# EAGLE design printer_v1 (EAGLE 9.6.2)
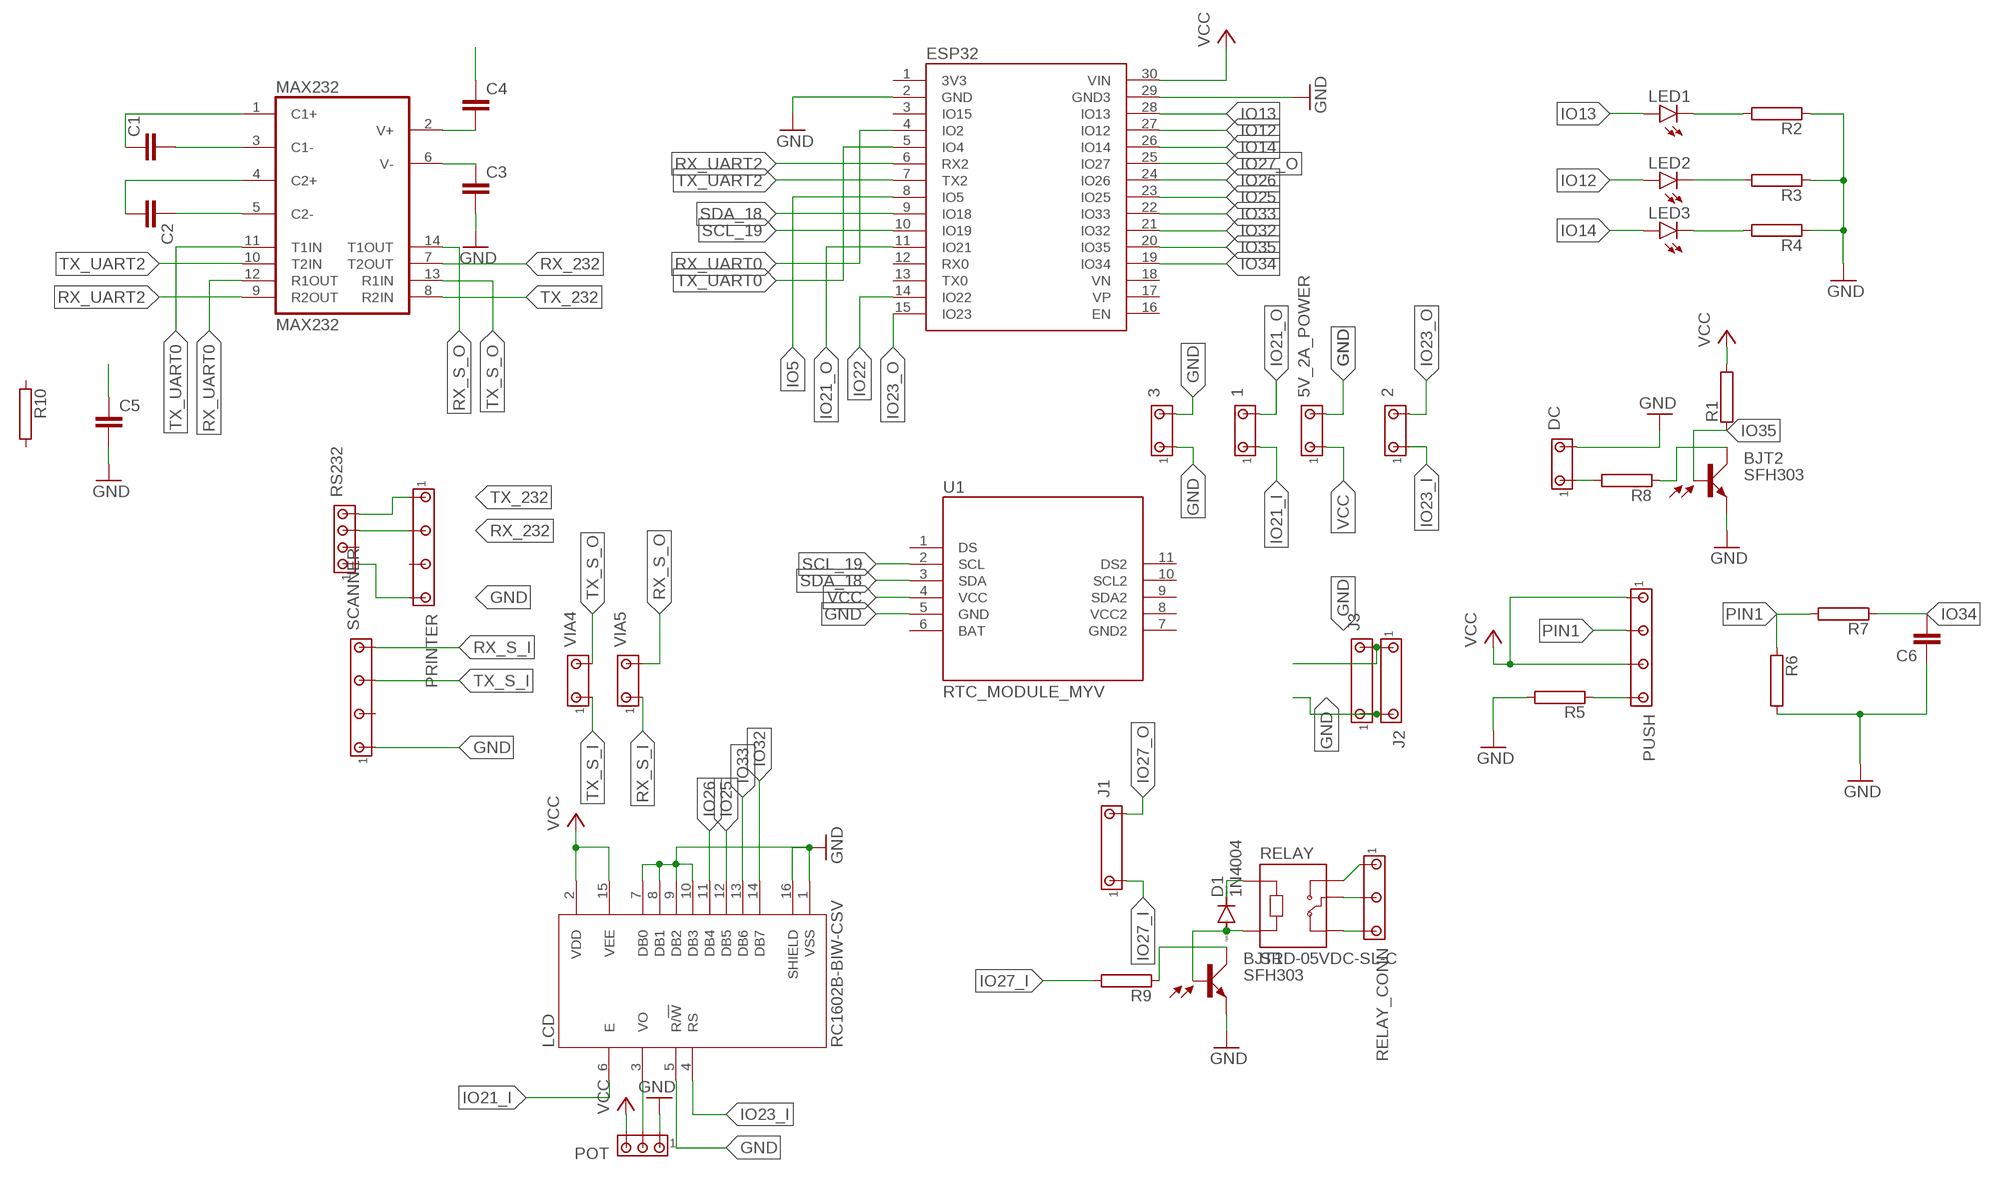
[diagram p0: schematic, sheet 1]

## Parts
1  MTA03-100_MYV  [10X03MTA_MYV]
2  MTA03-100_MYV  [10X03MTA_MYV]
3  MTA03-100_MYV  [10X03MTA_MYV]
5V_2A_POWER  MTA03-100_MYV  [10X03MTA_MYV]
BJT1  SFH303  [SFH303]
BJT2  SFH303  [SFH303]
C1  C-EU025-024X044  [C025-024X044]
C2  C-EU025-024X044  [C025-024X044]
C3  C-EU025-024X044  [C025-024X044]
C4  C-EU025-024X044  [C025-024X044]
C5  C-EU025-024X044  [C025-024X044]
C6  C-EU025-024X044  [C025-024X044]
D1  1N4004  [DO41-10]
DC  MTA03-100_MYV  [10X03MTA_MYV]
ESP32  MODULE_ESP32_MYV  [MODULE_ESP32-DEVKITC-MYV]
J1  MTA02-LARGE_MYVSPACE1  [10X02MTA_LARGE_MYV]
J2  MTA02-LARGE_MYVSPACE1  [10X02MTA_LARGE_MYV]
J3  MTA02-LARGE_MYVSPACE1  [10X02MTA_LARGE_MYV]
LCD  RC1602B-BIW-CSV  [LCD_RC1602B-BIW-CSV]
LED1  LED3MM  [LED3MM]
LED2  LED3MM  [LED3MM]
LED3  LED3MM  [LED3MM]
MAX232  MAX232  [DIL16]
POT  MTA03-100  [10X03MTA]
PRINTER  MTA07-100_MYV  [10X07MTA_MYV]
PUSH  MTA07-100_MYV  [10X07MTA_MYV]
R1  RHPS58  [HPS58]
R2  RHPS58  [HPS58]
R3  RHPS58  [HPS58]
R4  RHPS58  [HPS58]
R5  RHPS58  [HPS58]
R6  RHPS58  [HPS58]
R7  RHPS58  [HPS58]
R8  RHPS58  [HPS58]
R9  RHPS58  [HPS58]
R10  RHPS58  [HPS58]
RELAY  SRD-05VDC-SL-C  [RELAY_SRD-05VDC-SL-C]
RELAY_CONN  MTA05-156_MYVSPACE1  [10X05MTA_MYV]
RS232  MTA04-100  [10X04MTA]
SCANNER  MTA07-100_MYV  [10X07MTA_MYV]
U1  RTC_MODULE_MYV  [RTC_MYV]
VIA4  MTA03-100_MYV  [10X03MTA_MYV]
VIA5  MTA03-100_MYV  [10X03MTA_MYV]

## Nets
GND: 3.1 3.3 5V_2A_POWER.3 BJT1.1(E) BJT2.1(E) C3.2 C5.2 C6.1 DC.3 ESP32.2(GND) ESP32.29(GND3) J2.1 J2.5 J3.1 J3.5 LCD.1(VSS) LCD.5(R/!W) LCD.7(DB0) LCD.8(DB1) LCD.9(DB2) LCD.10(DB3) LCD.16(SHIELD) POT.1 PRINTER.7 R2.1 R3.1 R4.1 R5.2 R6.2 RS232.1 SCANNER.1 U1.5(GND)
IO5: ESP32.8(IO5)
IO12: ESP32.27(IO12) LED2.A
IO13: ESP32.28(IO13) LED1.A
IO14: ESP32.26(IO14) LED3.A
IO21_I: 1.1 LCD.6(E)
IO21_O: 1.3 ESP32.11(IO21)
IO22: ESP32.14(IO22)
IO23_I: 2.1 LCD.4(RS)
IO23_O: 2.3 ESP32.15(IO23)
IO25: ESP32.23(IO25) LCD.12(DB5)
IO26: ESP32.24(IO26) LCD.11(DB4)
IO27_I: J1.1 R9.2
IO27_O: ESP32.25(IO27) J1.5
IO32: ESP32.21(IO32) LCD.14(DB7)
IO33: ESP32.22(IO33) LCD.13(DB6)
IO34: C6.2 ESP32.19(IO34) R7.1
IO35: BJT2.3(B) ESP32.20(IO35) R1.1
N$1: C1.1 MAX232.1(C1+)
N$2: C1.2 MAX232.3(C1-)
N$3: C2.1 MAX232.5(C2-)
N$4: C2.2 MAX232.4(C2+)
N$5: C3.1 MAX232.6(V-)
N$6: C4.2 MAX232.2(V+)
N$7: D1.C RELAY.A1
N$8: BJT1.2(C) R9.1
N$9: RELAY.NC RELAY_CONN.5
N$10: RELAY.COM RELAY_CONN.3
N$11: RELAY.NO RELAY_CONN.1
N$12: LED1.K(C) R2.2
N$13: LED2.K(C) R3.2
N$14: BJT2.2(C) R8.1
N$15: LED3.K(C) R4.2
N$16: LCD.3(VO) POT.2
N$17: DC.1 R8.2
N$18: C4.1
N$19: BJT1.3(B) D1.A RELAY.A2
N$20: PUSH.7 R5.1
N$21: C5.1
PIN1: PUSH.3 R6.1 R7.2
RX_232: MAX232.7(T2OUT) PRINTER.3 RS232.3
RX_S_I: SCANNER.7 VIA5.1
RX_S_O: MAX232.14(T1OUT) VIA5.3
RX_UART0: ESP32.4(IO2) MAX232.12(R1OUT)
RX_UART2: ESP32.6(RX2) MAX232.9(R2OUT)
SCL_19: ESP32.10(IO19) U1.2(SCL)
SDA_18: ESP32.9(IO18) U1.3(SDA)
TX_232: MAX232.8(R2IN) PRINTER.1 RS232.4
TX_S_I: SCANNER.5 VIA4.1
TX_S_O: MAX232.13(R1IN) VIA4.3
TX_UART0: ESP32.5(IO4) MAX232.11(T1IN)
TX_UART2: ESP32.7(TX2) MAX232.10(T2IN)
VCC: 5V_2A_POWER.1 ESP32.30(VIN) LCD.2(VDD) LCD.15(VEE) POT.3 PUSH.1 PUSH.5 R1.2 U1.4(VCC)
Unconnected: ESP32.3(IO15) ESP32.12(RX0) ESP32.13(TX0) ESP32.16(EN) ESP32.17(VP) ESP32.18(VN) PRINTER.5 R10.1 R10.2 RS232.2 SCANNER.3 U1.1(DS) U1.6(BAT) U1.7(GND2) U1.8(VCC2) U1.9(SDA2) U1.10(SCL2) U1.11(DS2)

## Power pins joined to a net without a drawn wire
3V3: ESP32.1(3V3)
GND: MAX232.15(GND)
VCC: MAX232.16(VCC)

## Library data of the parts
1-3 5V_2A_POWER DC VIA4 VIA5 = con-amp_edit:MTA03-100_MYV: AMP connector
BJT1 BJT2 = opto-trans-siemens:SFH303: Silicium NPN Phototransistor Source: Siemens; OC_FARNELL: unknown; OC_NEWARK: unknown
C1-C6 = rcl:C-EU: CAPACITOR, European symbol; SPICEPREFIX: C
D1 = diode:1N4004: DIODE general purpose rectifier, 1 A
ESP32 = ESP32-DEVKITC-32D:MODULE_ESP32_MYV
J1-J3 = con-amp_edit:MTA02-LARGE_MYV: AMP connector
LCD = RC1602B-BIW-CSV:RC1602B-BIW-CSV: Display: LCD; alphanumeric; STN Negative; 16x2; blue; LED; PIN: 16; AVAILABILITY: Unavailable; DESCRIPTION: Display: LCD; alphanumeric; STN Negative; 16x2; blue; LED; PIN: 16; MF: Raystar; MP: RC1602B-BIW-CSV; PACKAGE: None; PRICE: None
LED1-LED3 = led:LED: LED OSRAM: - CHIPLED LG R971, LG N971, LY N971, LG Q971, LY Q971, LO R971, LY R971 LH N974, LH R974 LS Q976, LO Q976, LY Q976 LO Q996 - Hyper CHIPLED LW Q18S LB Q993, LB Q99A, LB R99A - SideLED LS A670, LO A670, LY A670, LG A670, LP A670 LB A673, LV A673, LT A673, LW A673 LH A674 LY A675 LS A676, LA A676, LO A676, LY A676, LW A676 LS A679, LY A679, LG A679 - Hyper Micro SIDELED® LS Y876, LA Y876, LO Y876, LY Y876 LT Y87S - SmartLED LW L88C, LW L88S LB L89C, LB L89S, LG L890 LS L89K, LO L89K, LY L89K LS L896, LA L896, LO L896, LY L896 - TOPLED LS T670, LO T670, LY T670, LG T670, LP T670 LSG T670, LSP T670, LSY T670, LOP T670, LYG T670 LG T671, LOG T671, LSG T671 LB T673, LV T673, LT T673, LW T673 LH T674 LS T676, LA T676, LO T676, LY T676, LB T676, LH T676, LSB T676, LW T676 LB T67C, LV T67C, LT T67C, LS T67K, LO T67K, LY T67K, LW E67C LS E67B, LA E67B, LO E67B, LY E67B, LB E67C, LV E67C, LT E67C LW T67C LS T679, LY T679, LG T679 LS T770, LO T770, LY T770, LG T770, LP T770 LB T773, LV T773, LT T773, LW T773 LH T774 LS E675, LA E675, LY E675, LS T675 LS T776, LA T776, LO T776, LY T776, LB T776 LHGB T686 LT T68C, LB T68C - Hyper Mini TOPLED® LB M676 - Mini TOPLED Santana® LG M470 LS M47K, LO M47K, LY M47K Source: http://www.osram.convergy.de LUXEON: - LUMILED® LXK2-PW12-R00, LXK2-PW12-S00, LXK2-PW14-U00, LXK2-PW14-V00 LXK2-PM12-R00, LXK2-PM12-S00, LXK2-PM14-U00 LXK2-PE12-Q00, LXK2-PE12-R00, LXK2-PE12-S00, LXK2-PE14-T00, LXK2-PE14-U00 LXK2-PB12-K00, LXK2-PB12-L00, LXK2-PB12-M00, LXK2-PB14-N00, LXK2-PB14-P00, LXK2-PB14-Q00 LXK2-PR12-L00, LXK2-PR12-M00, LXK2-PR14-Q00, LXK2-PR14-R00 LXK2-PD12-Q00, LXK2-PD12-R00, LXK2-PD12-S00 LXK2-PH12-R00, LXK2-PH12-S00 LXK2-PL12-P00, LXK2-PL12-Q00, LXK2-PL12-R00 Source: www.luxeon.com KINGBRIGHT: KA-3528ASYC Source: www.kingbright.com
MAX232 = maxim:MAX232: RS232 TRANSCEIVER; MF: MAXIM; MPN: MAX232ACPE+; OC_FARNELL: 9723773; OC_NEWARK: 68K4544
POT = con-amp:MTA03-100: AMP connector
PRINTER PUSH SCANNER = con-amp_edit:MTA07-100_MYV: AMP connector
R1-R10 = resistor-power:R: Power Resitor; OC_FARNELL: unknown; OC_NEWARK: unknown
RELAY = SRD-05VDC-SL-C:SRD-05VDC-SL-C: 5V Trigger Relay Module For Arduino And Raspberry Pi 5V Trigger Relay Module For Arduino And Raspberry Pi; AVAILABILITY: Unavailable; DESCRIPTION: 5V Trigger Relay Module For Arduino And Raspberry Pi 5V Trigger Relay Module For Arduino And Raspberry Pi; MF: Songle Relay; MP: SRD-05VDC-SL-C; PACKAGE: None; PRICE: None
RELAY_CONN = con-amp_edit:MTA05-156_MYV: AMP connector
RS232 = con-amp:MTA04-100: AMP connector
U1 = ESP32-DEVKITC-32D:RTC_MODULE_MYV: ESP32-DEVKITC; AVAILABILITY: Unavailable; DESCRIPTION: ESP32-DEVKITC; MF: Espressif Systems; MP: ESP32-DevKitC; PACKAGE: None; PRICE: None

## Board
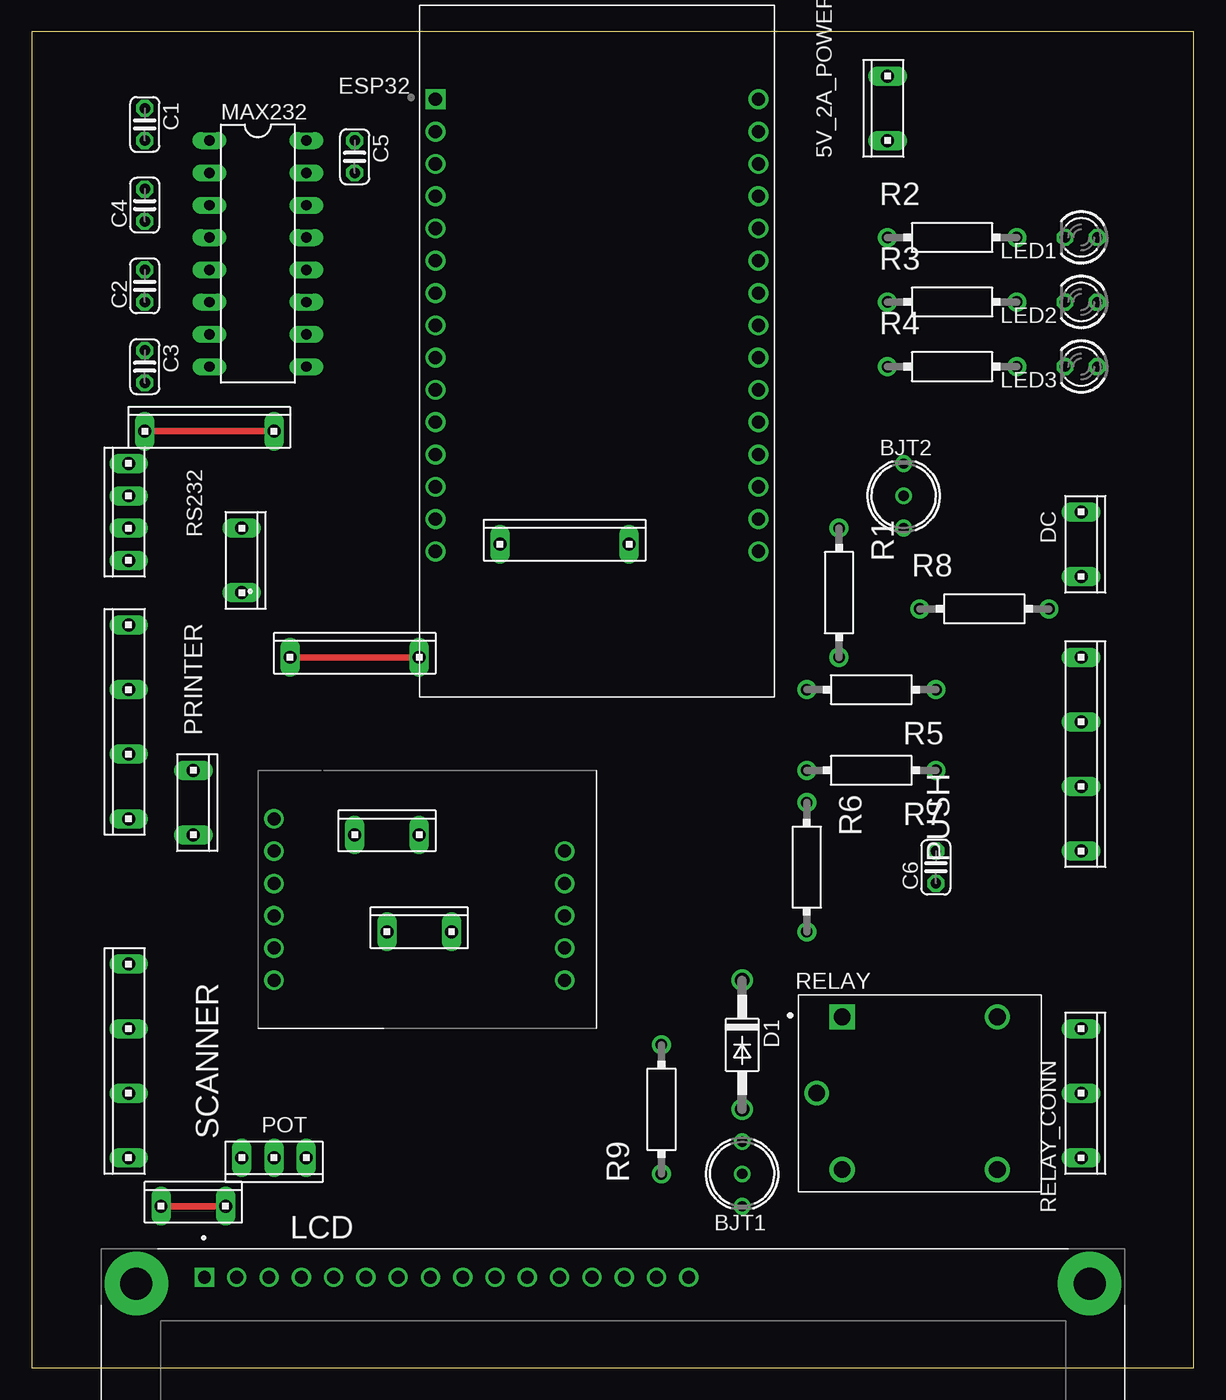
[diagram p1: board, top side]
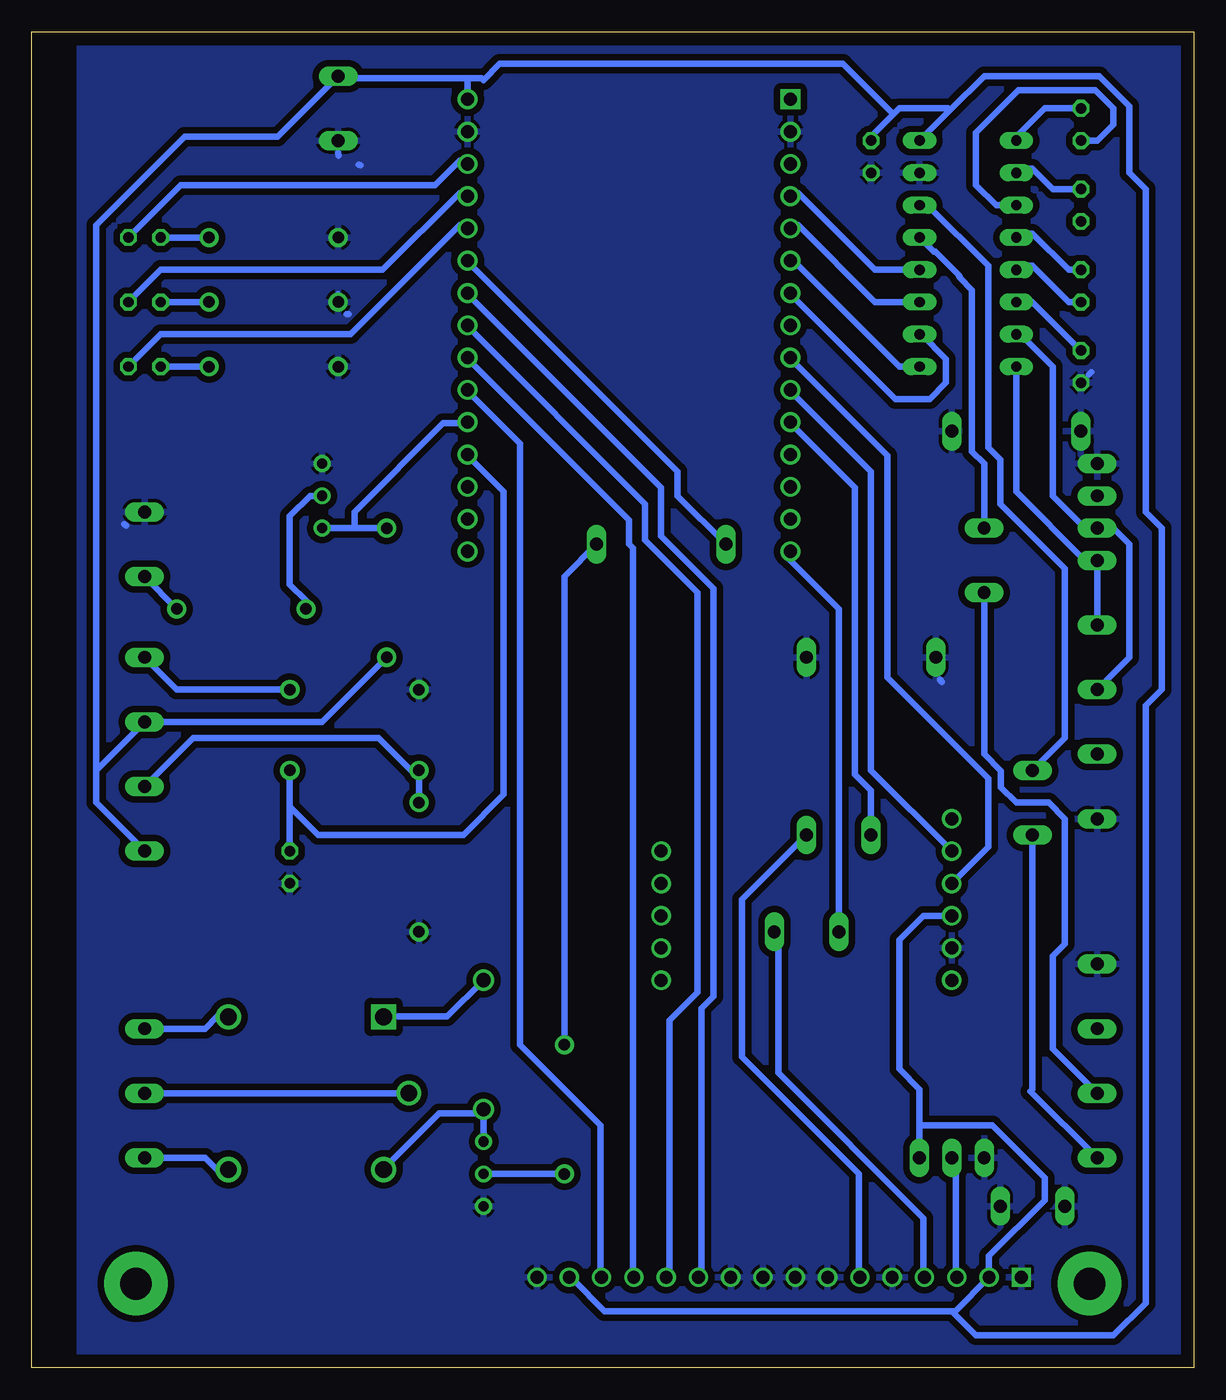
[diagram p2: board, bottom side, seen from below]

Size 91.42 x 105.08 mm. Coordinates in mm from the lower left corner, seen from the top.
Outline: 0,0 91.42,0 91.42,105.08 0,105.08 0,0
Copper layers (1*16): Top 0.035mm / dielectric 1.5mm / Bottom 0.035mm
Design rules "default *": minimum track width 20mil, minimum drill 0.35mm, track to track 20mil, track to pad 20mil, pad to pad 20mil, via to via 20mil, smd to smd 20mil, copper to edge 40mil, drill to drill 20mil, minimum pad ring 10mil, minimum via ring 8mil, stop-mask expansion 4mil, vias tented up to drill 0mil, thermal gap 10mil

### Footprints (pad centres in the part's own frame; a part is rotated, then mirrored left to right if it is on the bottom)
10X03MTA_MYV = drill 1.016 long: 1 2.54,0; 3 -2.54,0
SFH303 = drill 0.8 pad 1.3: 1 0,2.54; 2 0,0; 3 0,-2.54
C025-024X044 = drill 0.813 octagon: 1 -1.27,0; 2 1.27,0
DO41-10 = drill 1.118: A 5.08,0; C -5.08,0
MODULE_ESP32-DEVKITC-MYV = drill 1.04 square: 1 -12.7,19.76 | drill 1.04: 2 -12.7,17.22; 3 -12.7,14.68; 4 -12.7,12.14; 5 -12.7,9.6; 6 -12.7,7.06; 7 -12.7,4.52; 8 -12.7,1.98; 9 -12.7,-0.56; 10 -12.7,-3.1; 11 -12.7,-5.64; 12 -12.7,-8.18; 13 -12.7,-10.72; 14 -12.7,-13.26; 15 -12.7,-15.8; 16 12.7,-15.8; 17 12.7,-13.26; 18 12.7,-10.72; 19 12.7,-8.18; 20 12.7,-5.64; 21 12.7,-3.1; 22 12.7,-0.56; 23 12.7,1.98; 24 12.7,4.52; 25 12.7,7.06; 26 12.7,9.6; 27 12.7,12.14; 28 12.7,14.68; 29 12.7,17.22; 30 12.7,19.76
10X02MTA_LARGE_MYV = drill 1.016 long: 1 5.08,0; 5 -5.08,0
LCD_RC1602B-BIW-CSV = drill 1 square: 1 -32.14,16 | drill 1: 2 -29.6,16; 3 -27.06,16; 4 -24.52,16; 5 -21.98,16; 6 -19.44,16; 7 -16.9,16; 8 -14.36,16; 9 -11.82,16; 10 -9.28,16; 11 -6.74,16; 12 -4.2,16; 13 -1.66,16; 14 0.88,16; 15 3.42,16; 16 5.96,16 | drill 2.5 pad 5: S1 -37.5,15.5; S2 37.5,15.5
LED3MM = drill 0.813 octagon: A -1.27,0; K 1.27,0
DIL16 = drill 0.813 long: 1 -8.89,-3.81; 2 -6.35,-3.81; 3 -3.81,-3.81; 4 -1.27,-3.81; 5 1.27,-3.81; 6 3.81,-3.81; 7 6.35,-3.81; 8 8.89,-3.81; 9 8.89,3.81; 10 6.35,3.81; 11 3.81,3.81; 12 1.27,3.81; 13 -1.27,3.81; 14 -3.81,3.81; 15 -6.35,3.81; 16 -8.89,3.81
10X03MTA = drill 1.016 long: 1 2.54,0; 2 0,0; 3 -2.54,0
10X07MTA_MYV = drill 1.016 long: 1 7.62,0; 3 2.54,0; 5 -2.54,0; 7 -7.62,0
HPS58 = drill 0.9 pad 1.5: 1 -5.08,0; 2 5.08,0
RELAY_SRD-05VDC-SL-C = drill 1.32 square: A1 -6.1,6 | drill 1.32: A2 -6.1,-6; NC 6.1,6; NO 6.1,-6 | drill 1.29: COM -8.1,0
10X05MTA_MYV = drill 1.016 long: 1 5.08,0; 3 0,0; 5 -5.08,0
10X04MTA = drill 1.016 long: 1 3.81,0; 2 1.27,0; 3 -1.27,0; 4 -3.81,0
RTC_MYV = drill 1.02: 1 -12.7,5.07; 2 -12.7,2.53; 3 -12.7,-0.01; 4 -12.7,-2.55; 5 -12.7,-5.09; 6 -12.7,-7.63; 7 10.16,-7.63; 8 10.16,-5.09; 9 10.16,-2.55; 10 10.16,-0.01; 11 10.16,2.53

### Placement (x,y rotation side)
1  27.94,41.91 0 top
2  30.48,34.29 0 top
3  12.7,12.7 0 top
5V_2A_POWER  67.31,99.06 90 top
BJT1  55.88,15.24 180 top
BJT2  68.58,68.58 0 top
C1  8.89,97.79 270 top
C2  8.89,85.09 90 top
C3  8.89,78.74 270 top
C4  8.89,91.44 90 top
C5  25.4,95.25 270 top
C6  71.12,39.37 90 top
D1  55.88,25.4 270 top
DC  82.55,64.77 270 top
ESP32  44.45,80.01 0 top
J1  41.91,64.77 0 top
J2  25.4,55.88 0 top
J3  13.97,73.66 0 top
LCD  45.72,-8.89 0 top
LED1  82.55,88.9 180 top
LED2  82.55,83.82 180 top
LED3  82.55,78.74 180 top
MAX232  17.78,87.63 270 top
POT  19.05,16.51 180 top
PRINTER  7.62,50.8 90 top
PUSH  82.55,48.26 270 top
R1  63.5,60.96 270 top
R2  72.39,88.9 0 top
R3  72.39,83.82 0 top
R4  72.39,78.74 0 top
R5  66.04,53.34 180 top
R6  60.96,39.37 270 top
R7  66.04,46.99 180 top
R8  74.93,59.69 0 top
R9  49.53,20.32 90 top
R10  6.35,-35.56 0 top  (outside the outline)
RELAY  69.85,21.59 0 top
RELAY_CONN  82.55,21.59 270 top
RS232  7.62,67.31 90 top
SCANNER  7.62,24.13 90 top
U1  31.75,38.1 0 top
VIA4  16.51,63.5 270 top
VIA5  12.7,44.45 270 top

### Tracks (layer width: path | path; a pad name or v marks a point on that pad's centre or on a via)
GND
  Top 0.508: J3.5 J3.1 | J2.5 J2.1 | 3.3 3.1
  Bottom 0.508: 8.26,78.11 8.06,78.3 | 67.31,84.45 R3.1 | 66.68,82.87 66.49,82.86 | 65.72,94.61 65.55,94.58 | 7.62,31.91 SCANNER.1 | 67.31,95.57 67.29,95.34 | 84.14,66.36 83.98,66.22 | 15.24,12.86 3.1 | 20,54.13 19.83,53.94 | J2.5 20.16,56.04 20.32,56.04 | U1.5 | RS232.1 | 7.78,71.12 RS232.1 | R2.1 | DC.3 | R5.2 | 3.3
  pour Bottom: 1.27,104.14 87.63,104.14 87.63,0 1.27,0
IO12
  Bottom 0.508: LED2.A 81.28,86.36 63.82,86.36 57.79,92.39 57.15,92.39 ESP32.27
IO13
  Bottom 0.508: LED1.A 79.69,93.03 59.69,93.03 57.79,94.93 57.15,94.93 ESP32.28
IO14
  Bottom 0.508: LED3.A 81.28,81.28 66.36,81.28 57.79,89.85 57.15,89.85 ESP32.26
IO21_I
  Bottom 0.508: 1.1 35.56,36.83 35.56,24.45 26.35,15.24 26.35,7.3 LCD.6
IO21_O
  Bottom 0.508: 1.3 25.4,45.4 26.67,46.67 26.67,69.21 31.75,74.3 ESP32.11
IO23_I
  Bottom 0.508: 2.1 32.7,33.97 32.7,23.18 21.27,11.75 21.27,7.3 LCD.4
IO23_O
  Bottom 0.508: 2.3 27.94,59.69 31.75,63.5 ESP32.15
IO25
  Bottom 0.508: LCD.12 41.27,7.3 41.27,27.3 39.05,29.53 39.05,60.96 43.18,65.09 43.18,67.95 57.15,81.92 ESP32.23
IO26
  Bottom 0.508: LCD.11 38.74,7.3 38.74,28.26 37.78,29.21 37.78,61.28 41.91,65.4 41.91,69.21 57.15,84.45 ESP32.24
IO27_I
  Bottom 0.508: R9.2 49.53,62.23 J1.1
IO27_O
  Bottom 0.508: J1.5 40.64,68.58 40.64,70.48 57.15,86.99 ESP32.25
IO32
  Bottom 0.508: LCD.14 46.67,7.3 46.67,19.05 53.02,25.4 53.02,72.71 57.15,76.83 ESP32.21
IO33
  Bottom 0.508: LCD.13 44.13,7.3 44.13,64.45 44.45,64.77 44.45,66.67 57.15,79.37 ESP32.22
IO34
  Bottom 0.508: R7.1 71.12,44.13 | 71.12,44.13 C6.2 | 71.12,44.13 68.9,41.91 57.47,41.91 54.29,45.08 54.29,68.9 57.15,71.76 ESP32.19
IO35
  Bottom 0.508: R1.1 66.04,66.04 | 66.04,66.04 BJT2.3 | 66.04,66.04 66.04,67.31 59.05,74.3 57.15,74.3 ESP32.20
N$1
  Bottom 0.508: C1.1 11.75,99.06 13.97,96.84 MAX232.1
N$2
  Bottom 0.508: MAX232.3 15.56,91.44 17.15,93.03 17.15,97.15 13.82,100.48 7.77,100.48 6.35,99.06 6.35,97.79 7.62,96.52 C1.2
N$3
  Bottom 0.508: C2.1 9.84,83.82 12.7,86.68 13.65,86.68 MAX232.5
N$4
  Bottom 0.508: C2.2 9.84,86.36 12.7,89.22 13.65,89.22 MAX232.4
N$5
  Bottom 0.508: C3.1 12.7,83.82 MAX232.6
N$6
  Bottom 0.508: C4.2 11.11,92.71 12.7,94.3 13.65,94.3 MAX232.2
N$7
  Bottom 0.508: D1.C 58.74,27.62 63.5,27.62 RELAY.A1
N$8
  Bottom 0.508: R9.1 BJT1.2
N$9
  Bottom 0.508: RELAY_CONN.5 77.79,26.67 76.84,27.62 76.2,27.62 RELAY.NC
N$10
  Bottom 0.508: RELAY.COM RELAY_CONN.3
N$11
  Bottom 0.508: RELAY_CONN.1 77.79,16.51 76.84,15.56 76.2,15.56 RELAY.NO
N$12
  Bottom 0.508: R2.2 LED1.K
N$13
  Bottom 0.508: R3.2 LED2.K
N$14
  Bottom 0.508: BJT2.2 69.53,68.58 71.12,66.99 71.12,61.6 69.85,60.33 R8.1
N$15
  Bottom 0.508: R4.2 LED3.K
N$16
  Bottom 0.508: LCD.3 18.73,7.3 18.73,16.19 POT.2
N$17
  Bottom 0.508: DC.1 R8.2
N$19
  Bottom 0.508: 55.88,20 BJT1.3 | 55.88,20 59.37,20 63.5,15.88 RELAY.A2 | 55.88,20 D1.A
N$20
  Bottom 0.508: R5.1 80.01,53.34 PUSH.7
PIN1
  Bottom 0.508: 60.96,46.36 R6.1 | PUSH.3 78.74,49.53 64.13,49.53 60.96,46.36 | 60.96,46.36 R7.2
RX_232
  Bottom 0.508: MAX232.7 13.65,81.28 11.11,78.74 11.11,68.58 8.57,66.04 RS232.3 6.35,66.04 5.08,64.77 5.08,55.88 PRINTER.3
RX_S_I
  Bottom 0.508: VIA5.1 12.7,21.91 12.86,21.75 SCANNER.7
RX_S_O
  Bottom 0.508: MAX232.14 20.96,91.44 16.19,86.68 16.19,72.39 15.24,71.44 15.24,67.95 10.16,62.86 10.16,49.53 VIA5.3
RX_UART0
  Bottom 0.508: MAX232.12 25.08,86.36 31.12,92.39 31.75,92.39 ESP32.4
RX_UART2
  Bottom 0.508: MAX232.9 23.18,78.74 31.75,87.31 ESP32.6
SCL_19
  Bottom 0.508: U1.2 25.4,46.99 25.4,70.48 31.75,76.83 ESP32.10
SDA_18
  Bottom 0.508: U1.3 16.19,40.96 16.19,46.36 24.13,54.29 24.13,71.76 31.75,79.37 ESP32.9
TX_232
  Bottom 0.508: MAX232.8 13.97,68.9 8.57,63.5 RS232.4 PRINTER.1
TX_S_I
  Bottom 0.508: SCANNER.5 11.11,25.08 11.11,32.39 10.16,33.34 10.16,43.18 11.43,44.45 13.97,44.45 15.18,45.66 15.18,46.93 16.51,48.26 VIA4.1
TX_S_O
  Bottom 0.508: MAX232.13 20.47,87.78 20.34,87.78 18.49,85.93 18.41,85.73 17.46,84.77 17.46,72.07 16.51,71.12 VIA4.3
TX_UART0
  Bottom 0.508: MAX232.11 25.08,83.82 31.12,89.85 31.75,89.85 ESP32.5
TX_UART2
  Bottom 0.508: ESP32.7 31.75,84.45 23.49,76.2 20.78,76.2 19.51,77.47 19.51,79.33 21.46,81.28 MAX232.10
VCC
  Bottom 0.508: 19.05,4.44 46.35,4.44 48.9,6.98 LCD.15 | R1.2 68.58,50.8 PUSH.5 86.36,46.99 | MAX232.16 19.21,98.9 | 19.21,98.9 16.51,101.6 7.45,101.6 5.08,99.23 5.08,93.98 3.81,92.71 3.81,67.31 2.54,66.04 2.54,53.34 3.81,52.07 3.81,5.08 6.35,2.54 17.15,2.54 19.05,4.44 | 23.65,98.58 23.18,99.06 19.37,99.06 19.21,98.9 | 23.65,98.58 25.4,96.84 | 23.65,98.58 27.62,102.55 54.61,102.55 55.88,101.28 56.04,101.44 57.15,101.44 | 86.36,46.99 86.36,89.85 79.38,96.84 72.07,96.84 5V_2A_POWER.1 67.15,101.44 57.15,101.44 | 86.36,46.99 86.36,44.45 PUSH.1 | U1.4 21.28,35.55 23.18,33.65 23.18,23.5 21.59,21.91 21.59,19.05 | 21.59,19.05 POT.3 | 21.59,19.05 15.88,19.05 11.75,14.92 11.75,13.18 16.12,8.8 LCD.2 18.79,4.44 19.05,4.44 | 57.15,101.44 ESP32.30

### Text on the board
tValues: VCC | GND | GND | GND | RX | TX | SIG | TX | GND | RX | VCC | PB | GND | VCC | GND | NC | TX | COM | RX | NO | ParkMe / GDS-500